# EAGLE design LCDbackpack (EAGLE 6.5.0)
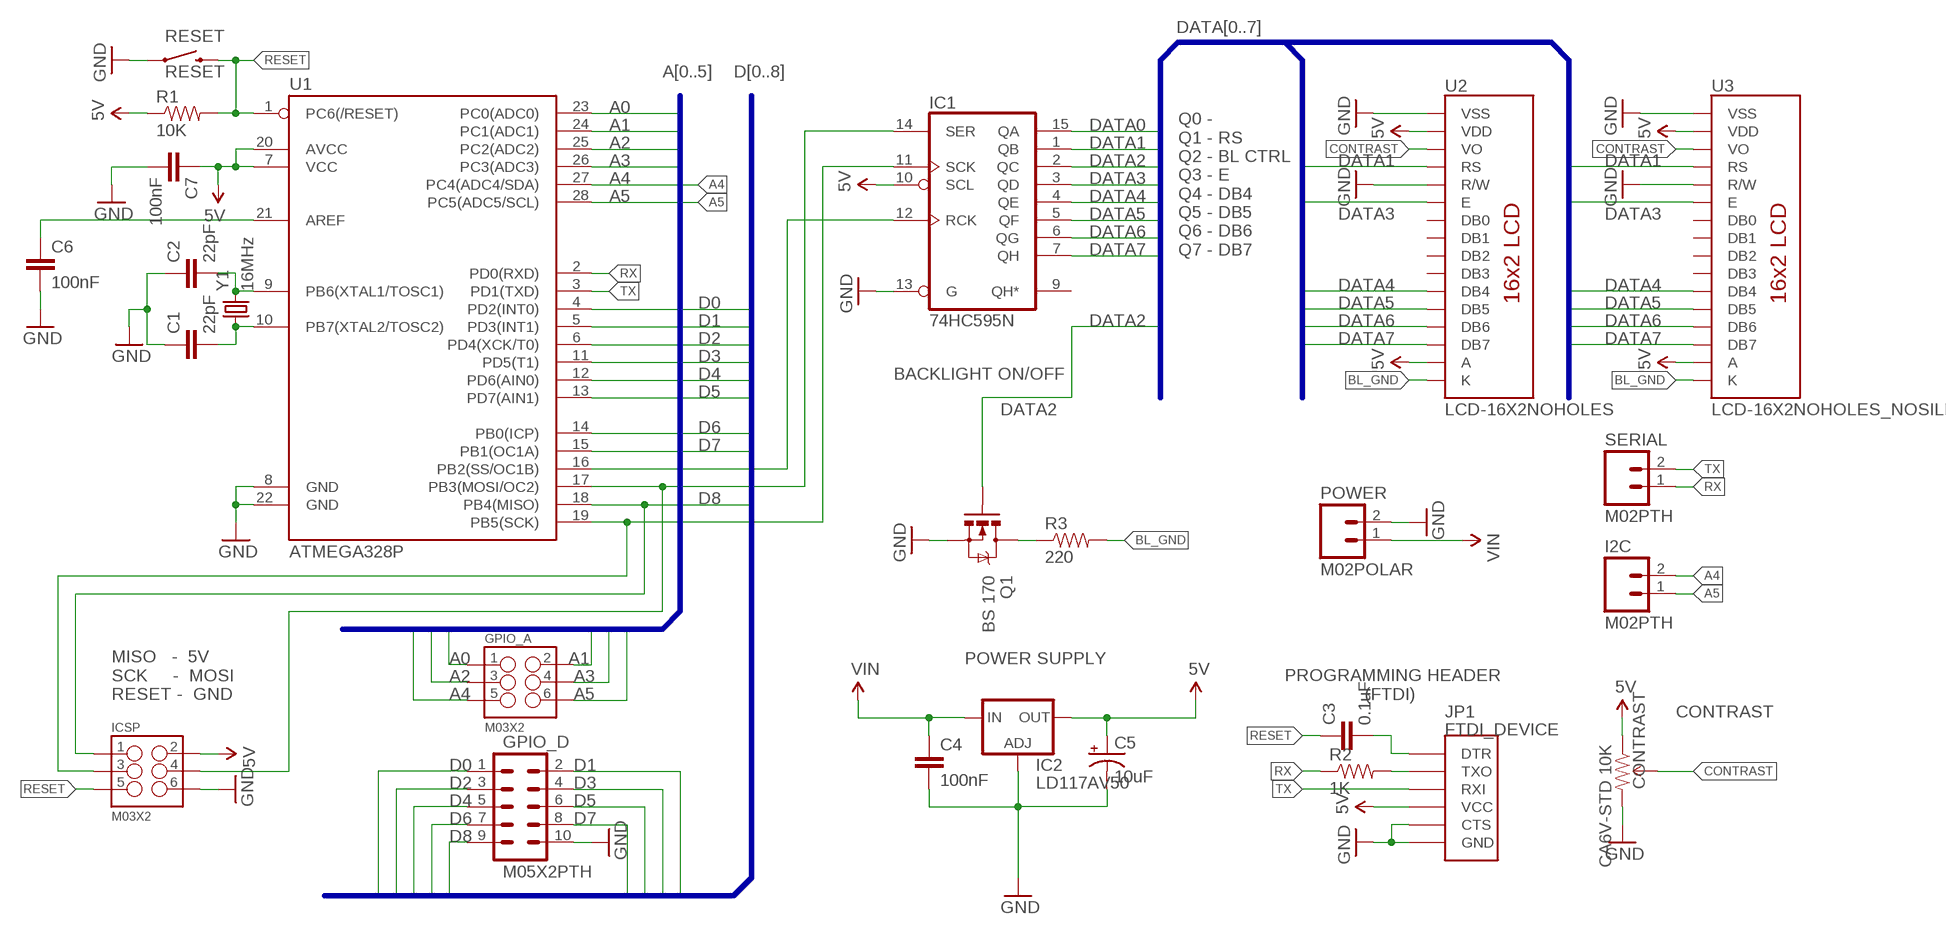
[diagram p0: schematic, sheet 1]

## Parts
C1  22pF  CAPPTH2  [CAP-PTH-SMALL2]
C2  22pF  CAPPTH2  [CAP-PTH-SMALL2]
C3  0.1uF  CAPPTH2  [CAP-PTH-SMALL2]
C4  100nF  CAPPTH2  [CAP-PTH-SMALL2]
C5  10uF  CAP_POLPTH2  [CPOL-RADIAL-10UF-25V]
C6  100nF  CAPPTH2  [CAP-PTH-SMALL2]
C7  100nF  CAPPTH2  [CAP-PTH-SMALL2]
CONTRAST  CA6V-STD 10K  TRIMPOTPTH  [TRIM_POT_PTH]
GPIO_A  M03X2  M03X22X3_SILK_MALE_PTH  [2X3]
GPIO_D  M05X2PTH  [AVR_ICSP]
I2C  M02PTH  [1X02]
IC1  74HC595N  [DIL16]
IC2  LD117AV50  [TO220L1]
ICSP  M03X2  M03X2POGO_PINS  [2X3_POGO]
JP1  FTDI_DEVICE  [FTDI_DEVICE_SIDE]
POWER  M02POLAR  [MOLEX-1X2]
Q1  BS 170  MOSFET-NCHANNEL2N7000  [TO-92]
R1  10K  RESISTORAXIAL-0.3  [AXIAL-0.3]
R2  1K  RESISTORAXIAL-0.3  [AXIAL-0.3]
R3  220  RESISTORAXIAL-0.3  [AXIAL-0.3]
RESET  RESET  SWITCH-MOMENTARY-2PTH  [TACTILE-PTH]
SERIAL  M02PTH  [1X02]
U1  ATMEGA328P  ATMEGA328P_PDIP  [DIL28-3]
U2  LCD-16X2NOHOLES  [LCD-16X2_NOHOLES]
U3  LCD-16X2NOHOLES_NOSILK  [LCD-8X2_NOHOLES_NOSILK]
Y1  16MHz  CRYSTALHC49US  [HC49US]

## Nets
A0: GPIO_A.1 U1.23(PC0(ADC0))
A1: GPIO_A.2 U1.24(PC1(ADC1))
A2: GPIO_A.3 U1.25(PC2(ADC2))
A3: GPIO_A.4 U1.26(PC3(ADC3))
A4: GPIO_A.5 I2C.2 U1.27(PC4(ADC4/SDA))
A5: GPIO_A.6 I2C.1 U1.28(PC5(ADC5/SCL))
BL_GND: R3.P$2 U2.16(K) U3.16(K)
CONTRAST: CONTRAST.2(WIPER) U2.3(VO) U3.3(VO)
D0: GPIO_D.1 U1.4(PD2(INT0))
D1: GPIO_D.2 U1.5(PD3(INT1))
D2: GPIO_D.3 U1.6(PD4(XCK/T0))
D3: GPIO_D.4 U1.11(PD5(T1))
D4: GPIO_D.5 U1.12(PD6(AIN0))
D5: GPIO_D.6 U1.13(PD7(AIN1))
D6: GPIO_D.7 U1.14(PB0(ICP))
D7: GPIO_D.8 U1.15(PB1(OC1A))
D8: GPIO_D.9 ICSP.P$1 U1.18(PB4(MISO))
DATA0: IC1.15(QA)
DATA1: IC1.1(QB) U2.4(RS) U3.4(RS)
DATA2: IC1.2(QC) Q1.2(G)
DATA3: IC1.3(QD) U2.6(E) U3.6(E)
DATA4: IC1.4(QE) U2.11(DB4) U3.11(DB4)
DATA5: IC1.5(QF) U2.12(DB5) U3.12(DB5)
DATA6: IC1.6(QG) U2.13(DB6) U3.13(DB6)
DATA7: IC1.7(QH) U2.14(DB7) U3.14(DB7)
GND: C1.1 C2.1 C4.2 C5.2(-) C6.2 C7.2 CONTRAST.3(CW) GPIO_D.10 IC1.13(G) IC2.1(ADJ) ICSP.P$6 JP1.P$5(CTS) JP1.P$6(GND) POWER.2 Q1.1(S) RESET.1 U1.8(GND) U1.22(GND) U2.1(VSS) U2.5(R/W) U3.1(VSS) U3.5(R/W)
N$1: C3.2 JP1.P$1(DTR)
N$2: JP1.P$2(TXO) R2.P$2
N$3: C2.2 U1.9(PB6(XTAL1/TOSC1)) Y1.2
N$4: C1.2 U1.10(PB7(XTAL2/TOSC2)) Y1.1
N$5: IC1.14(SER) ICSP.P$4 U1.17(PB3(MOSI/OC2))
N$6: Q1.3(D) R3.P$1
N$8: IC1.12(RCK) U1.16(PB2(SS/OC1B))
N$9: IC1.11(SCK) ICSP.P$3 U1.19(PB5(SCK))
N$10: C6.1 U1.21(AREF)
RESET: C3.1 ICSP.P$5 R1.P$2 RESET.3 U1.1(PC6(/RESET))
RX: R2.P$1 SERIAL.1 U1.2(PD0(RXD))
TX: JP1.P$3(RXI) SERIAL.2 U1.3(PD1(TXD))
VCC: C5.1(+) C7.1 CONTRAST.1(CCW) IC1.10(SCL) IC2.2(OUT) ICSP.P$2 JP1.P$4(VCC) R1.P$1 U1.7(VCC) U1.20(AVCC) U2.2(VDD) U2.15(A) U3.2(VDD) U3.15(A) ; supply symbol labelled 5V
VIN: C4.1 IC2.3(IN) POWER.1
Unconnected: IC1.9(QH*) U2.7(DB0) U2.8(DB1) U2.9(DB2) U2.10(DB3) U3.7(DB0) U3.8(DB1) U3.9(DB2) U3.10(DB3)

## Buses
DATA[0..7]
D[0..8]
A[0..5]

## Notes on the sheet
- Q0 - 
  Q1 - RS
  Q2 - BL CTRL
  Q3 - E
  Q4 - DB4
  Q5 - DB5
  Q6 - DB6
  Q7 - DB7
- BACKLIGHT ON/OFF
- POWER SUPPLY
- MISO   -  5V
  SCK     -  MOSI
  RESET -  GND
- PROGRAMMING HEADER
                  (FTDI)
- CONTRAST

## Power pins joined to a net without a drawn wire
GND: IC1.8(GND)
VCC: IC1.16(VCC)

## Library data of the parts
C1-C4 C6 C7 = SparkFun-Capacitors:CAP: Capacitor Standard 0603 ceramic capacitor, and 0.1" leaded capacitor.
C5 = SparkFun-Capacitors:CAP_POL: Capacitor Polarized These are standard SMD and PTH capacitors. Normally 10uF, 47uF, and 100uF in electrolytic and tantalum varieties. Always verify the external diameter of the through hole cap, it varies with capacity, voltage, and manufacturer. The EIA devices should be standard.
CONTRAST = SparkFun-Electromechanical:TRIMPOT: Various small potentiometers for "set-and-forget" applications
GPIO_A = SparkFun-Connectors:M03X2: 2x3 .1" header. Shrouded, with keying- CONN-10681 SMT- CONN-11415 Pogo pins- HW-11044; PROD_ID: CONN-09701
GPIO_D = SparkFun-Connectors:M05X2: Header 5x2 Standard 10-pin dual row 0.1" header. Commonly used with AVR-ISP. Use with Spark Fun Electronics SKU: PRT-00778
I2C POWER SERIAL = SparkFun-Connectors:M02: Standard 2-pin 0.1" header. Use with - straight break away headers ( PRT-00116) - right angle break away headers (PRT-00553) - swiss pins (PRT-00743) - machine pins (PRT-00117) - female headers (PRT-00115) Molex polarized connector foot print use with: PRT-08233 with associated crimp pins and housings. 2.54_SCREWTERM for use with PRT-10571. 3.5mm Screw Terminal footprints for PRT-08084 5mm Screw Terminal footprints for use with PRT-08432
IC1 = 74xx-eu:74*595: 8-bit SHIFT REGISTER, output latch
IC2 = v-reg:LD117A?*: Low drop fixed and adjustable positive voltage regulators 1 A Source: http://www.st.com/stonline/products/literature/ds/7194/ld1117axx.pdf
ICSP = SparkFun-Connectors:M03X2: 2x3 .1" header. Shrouded, with keying- CONN-10681 SMT- CONN-11415 Pogo pins- HW-11044; PROD_ID: HW-11044
JP1 = SparkFun-Connectors:FTDI_DEVICE: Connector which mates to FTDI basic or FTDI cable.
Q1 = SparkFun-DiscreteSemi:MOSFET-NCHANNEL: Common NMOSFET Parts MFG P/N Store ID Prod ID FDD8780 TRANS-09984 SI7820DN TRANS-11055 FDS6630A IC-08089 2N7002PW TRANS-11151 FQP30N06L COM-10213 TRANS-10060 BSS123LT1G TRANS-08345 BSS138 TRANS-00830 BS170 2N7000
R1-R3 = SparkFun-Passives:RESISTOR: Resistor Basic schematic elements and footprints for 0603, 1206, and PTH resistors.
RESET = SparkFun-Electromechanical:SWITCH-MOMENTARY-2: Various NO switches- pushbuttons, reed, etc
U1 = SparkFun-DigitalIC:ATMEGA328P_PDIP: uC used in the Arduino 32kb flash, 1k EEPROM, 2k SRAM This is the through-hole version of this chip.
U2 U3 = SparkFun-Displays:LCD-16X2: Standard text-only 16x2 parallel input LCD
Y1 = SparkFun-FreqCtrl:CRYSTAL: Various standard crystals. Proven footprints.

## Board
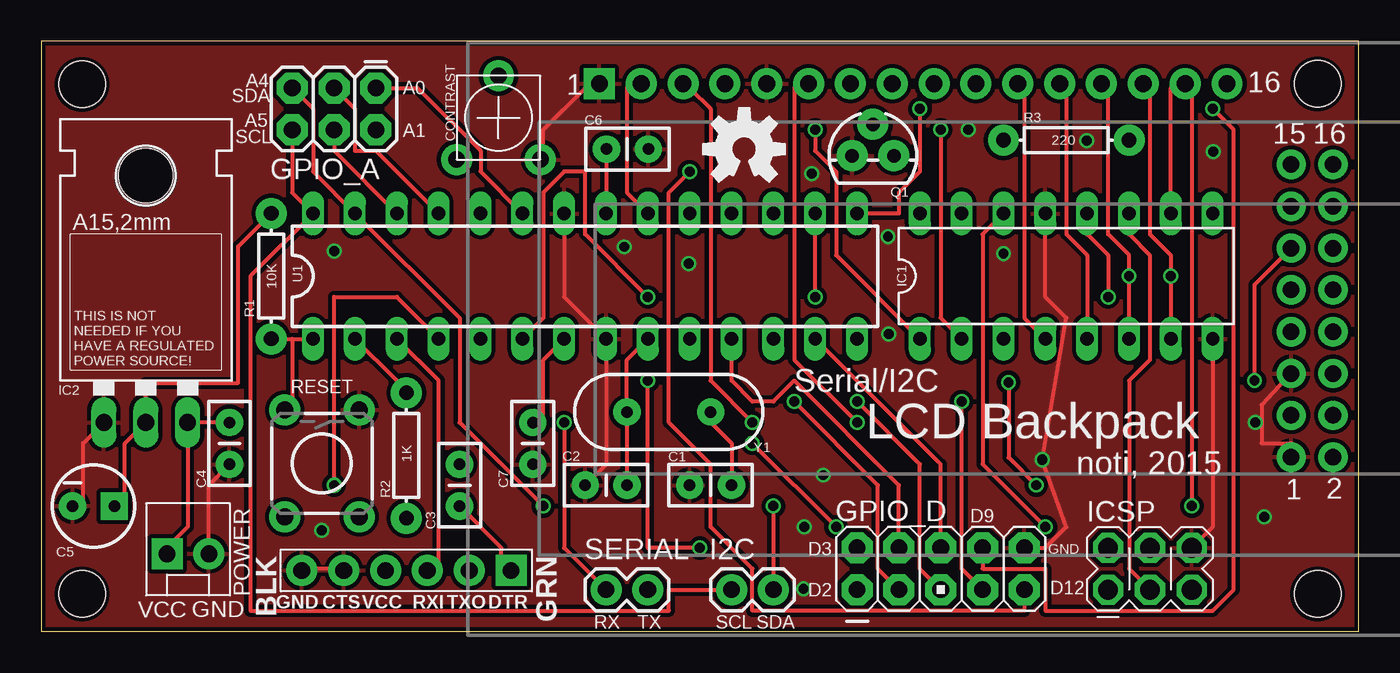
[diagram p1: board, top side]
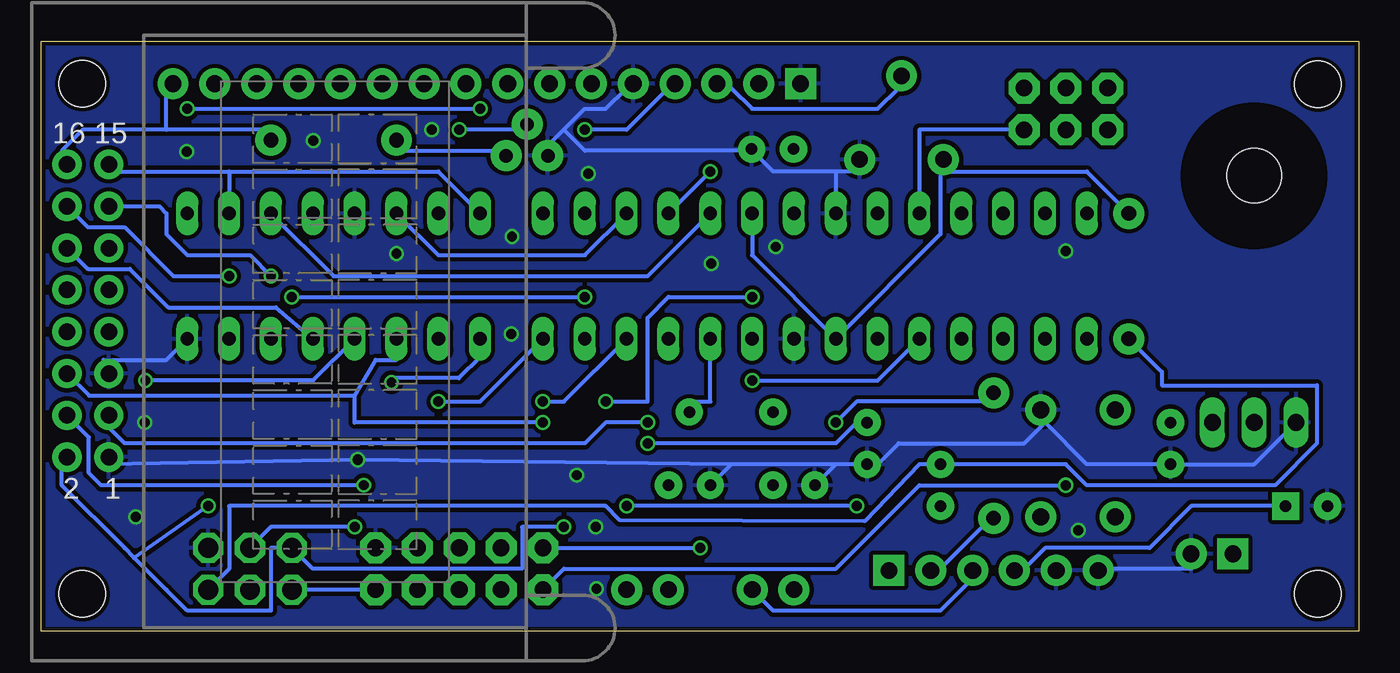
[diagram p2: board, bottom side, seen from below]

Size 79.99 x 35.87 mm. Coordinates in mm from the lower left corner, seen from the top.
Outline: 0,0 79.99,0 79.99,35.87 0,35.87 0,0
Copper layers (1*16): Top 0.035mm / dielectric 1.5mm / Bottom 0.035mm
Design rules "dirt_cheap_dirty_boards.v1": minimum track width 5mil, minimum drill 12mil, track to track 5mil, track to pad 5mil, pad to pad 5mil, via to via 5mil, smd to smd 0mil, copper to edge 10mil, drill to drill 10mil, minimum pad ring 10mil, minimum via ring 6mil, stop-mask expansion 2mil, vias tented up to drill 25mil, thermal gap 10mil
Holes 2.8 mm at 2.49,33.25 2.49,2.29 77.5,2.29 77.5,33.27

### Footprints (pad centres in the part's own frame; a part is rotated, then mirrored left to right if it is on the bottom)
CAP-PTH-SMALL2 = drill 0.7 pad 1.651: 1 0,0; 2 2.54,0
CPOL-RADIAL-10UF-25V = drill 0.7 pad 1.651 square: 1 1.27,0 | drill 0.7 pad 1.651: 2 -1.27,0
TRIM_POT_PTH = drill 1 pad 1.88: 1 -2.54,-2.54; 2 0,2.54; 3 2.54,-2.54
2X3 = drill 1.016 pad 1.88 octagon: 1 0,0; 2 0,2.54; 3 2.54,0; 4 2.54,2.54; 5 5.08,0; 6 5.08,2.54
AVR_ICSP = drill 1.016 pad 1.88 octagon: 1 -1.27,5.08; 2 1.27,5.08; 3 -1.27,2.54; 4 1.27,2.54; 5 -1.27,0; 6 1.27,0; 7 -1.27,-2.54; 8 1.27,-2.54; 9 -1.27,-5.08; 10 1.27,-5.08
1X02 = drill 1.016 pad 1.88: 1 0,0; 2 2.54,0
DIL16 = drill 0.813 long: 1 -8.89,-3.81; 2 -6.35,-3.81; 3 -3.81,-3.81; 4 -1.27,-3.81; 5 1.27,-3.81; 6 3.81,-3.81; 7 6.35,-3.81; 8 8.89,-3.81; 9 8.89,3.81; 10 6.35,3.81; 11 3.81,3.81; 12 1.27,3.81; 13 -1.27,3.81; 14 -3.81,3.81; 15 -6.35,3.81; 16 -8.89,3.81
TO220L1 = drill 1.016 long: 1 -2.54,-3.81; 2 0,-3.81; 3 2.54,-3.81 | hole 3.302: 0,11.176
2X3_POGO = drill 1.2 pad 1.829 octagon: P$1 0,0; P$2 0,2.54; P$3 2.54,0; P$4 2.54,2.54; P$5 5.08,0; P$6 5.08,2.54
FTDI_DEVICE_SIDE = drill 1.016 pad 1.88 square: P$1 -6.35,0 | drill 1.016 pad 1.88: P$2 -3.81,0; P$3 -1.27,0; P$4 1.27,0; P$5 3.81,0; P$6 6.35,0
MOLEX-1X2 = drill 1.016 pad 1.88 square: 1 0,0 | drill 1.016 pad 1.88: 2 2.54,0
TO-92 = drill 0.813 pad 1.88: 1 -1.27,0; 2 0,1.905; 3 1.27,0
AXIAL-0.3 = drill 0.9 pad 1.88: P$1 -3.81,0; P$2 3.81,0
TACTILE-PTH = drill 1.016 pad 1.88: 1 -3.251,2.261; 2 3.251,2.261; 3 -3.251,-2.261; 4 3.251,-2.261
DIL28-3 = drill 0.813 long: 1 -16.51,-3.81; 2 -13.97,-3.81; 3 -11.43,-3.81; 4 -8.89,-3.81; 5 -6.35,-3.81; 6 -3.81,-3.81; 7 -1.27,-3.81; 8 1.27,-3.81; 9 3.81,-3.81; 10 6.35,-3.81; 11 8.89,-3.81; 12 11.43,-3.81; 13 13.97,-3.81; 14 16.51,-3.81; 15 16.51,3.81; 16 13.97,3.81; 17 11.43,3.81; 18 8.89,3.81; 19 6.35,3.81; 20 3.81,3.81; 21 1.27,3.81; 22 -1.27,3.81; 23 -3.81,3.81; 24 -6.35,3.81; 25 -8.89,3.81; 26 -11.43,3.81; 27 -13.97,3.81; 28 -16.51,3.81
LCD-16X2_NOHOLES = drill 1.016 pad 1.88 square: 1 -32,15.5 | drill 1.016 pad 1.88: 2 -29.46,15.5; 3 -26.92,15.5; 4 -24.38,15.5; 5 -21.84,15.5; 6 -19.3,15.5; 7 -16.76,15.5; 8 -14.22,15.5; 9 -11.68,15.5; 10 -9.14,15.5; 11 -6.6,15.5; 12 -4.06,15.5; 13 -1.52,15.5; 14 1.02,15.5; 15 3.56,15.5; 16 6.1,15.5
LCD-8X2_NOHOLES_NOSILK = drill 1 pad 1.778: 1 -7.62,13.73; 2 -7.62,16.27; 3 -5.08,13.73; 4 -5.08,16.27; 5 -2.54,13.73; 6 -2.54,16.27; 7 0,13.73; 8 0,16.27; 9 2.54,13.73; 10 2.54,16.27; 11 5.08,13.73; 12 5.08,16.27; 13 7.62,13.73; 14 7.62,16.27; 15 10.16,13.73; 16 10.16,16.27
HC49US = drill 0.7 pad 1.651: 1 -2.54,0; 2 2.54,0

### Placement (x,y rotation side)
C1  39.37,8.89 0 top
C2  33.02,8.89 0 top
C3  25.4,10.16 270 top
C4  11.43,12.7 270 top
C5  3.17,7.62 0 top
C6  34.32,29.31 0 top
C7  29.84,12.7 270 top
CONTRAST  27.76,31.22 0 top
GPIO_A  20.32,33.02 180 top
GPIO_D  54.61,3.81 90 top
I2C  41.91,2.54 0 top
IC1  62.23,21.59 0 top
IC2  6.35,16.51 0 top
ICSP  64.77,2.54 0 top
JP1  22.17,3.71 180 top
POWER  7.65,4.72 0 top
Q1  50.5,28.91 0 top
R1  13.97,21.59 270 top
R2  22.17,10.69 270 top
R3  62.23,29.84 0 top
RESET  17.04,10.21 270 top
SERIAL  34.29,2.54 0 top
U1  33.02,21.59 0 top
U2  65.89,17.78 0 top
U3  62.15,18.21 90 bottom
U$1  [OSHW-LOGO-M]  42.67,29.31 0 top
Y1  38.1,13.34 180 top

### Tracks (layer width: path | path; a pad name or v marks a point on that pad's centre or on a via)
A0
  Top 0.254: U1.23 26.67,27.94 26.67,29.21 22.86,33.02 GPIO_A.1
A1
  Bottom 0.254: U1.24 26.67,30.48 GPIO_A.2
A2
  Top 0.254: U1.25 20.32,29.21 19.05,29.21 19.05,31.75 GPIO_A.3
A3
  Top 0.254: U1.26 17.78,29.21 GPIO_A.4
A4  (via drill 0.61)
  Top 0.254: GPIO_A.5 16.51,31.75 16.51,27.94 U1.27 25.4,19.05 25.4,12.7 v30.48,7.62 | v44.45,7.62 I2C.2
  Bottom 0.254: v30.48,7.62 v44.45,7.62
A5
  Top 0.254: GPIO_A.6 15.24,26.67 U1.28 12.7,21.59 12.7,1.27 38.1,1.27 38.1,2.54 I2C.1
BL_GND
  Bottom 0.254: 72.39,30.48 66.04,30.48 R3.P$2 | 72.39,30.48 77.47,30.48 78.74,29.21 U3.16 | 72.39,30.48 72.39,33.02 U2.16
CONTRAST  (via drill 0.61)
  Top 0.254: v43.18,12.7 40.64,15.24 40.64,31.75 39.37,33.02 U2.3
  Bottom 0.254: v43.18,12.7 45.72,12.7 46.99,11.43 74.93,11.43 76.2,12.7 U3.3 | CONTRAST.2 27.94,33.02 29.21,31.75 36.83,31.75 38.1,33.02 U2.3
D0  (via drill 0.61)
  Top 0.254: U1.4 21.59,20.32 17.78,20.32 v17.78,8.89
  Bottom 0.254: v17.78,8.89 26.67,8.89 31.75,3.81 48.26,3.81 GPIO_D.1
D1  (via drill 0.61)
  Top 0.254: v39.98,5.08 36.83,5.08 v36.83,15.24
  Bottom 0.254: U1.5 29.21,15.24 v36.83,15.24 | GPIO_D.2 v39.98,5.08
D2  (via drill 0.61)
  Top 0.254: U1.6 30.48,19.05 30.48,26.67 31.75,27.94 33.02,27.94 33.02,24.13 v36.83,20.32 | v45.72,13.97 50.8,8.89 50.8,3.81 GPIO_D.3
  Bottom 0.254: v36.83,20.32 41.91,20.32 43.18,19.05 43.18,13.97 v45.72,13.97
D3
  Top 0.254: U1.11 41.91,15.24 43.18,13.97 44.45,13.97 45.72,15.24 52.07,8.89 GPIO_D.4
D4  (via drill 0.61)
  Top 0.254: v49.53,13.97 53.34,10.16 53.34,3.81 GPIO_D.5
  Bottom 0.254: U1.12 48.26,13.97 v49.53,13.97
D5
  Top 0.254: U1.13 54.61,10.16 GPIO_D.6
D6  (via drill 0.61)
  Top 0.254: v55.88,13.97 55.88,3.81 GPIO_D.7
  Bottom 0.254: U1.14 53.34,13.97 v55.88,13.97
D7  (via drill 0.61)
  Top 0.254: U1.15 52.07,25.4 52.07,26.67 53.34,27.94 v53.34,31.75 | v71.12,31.75 72.39,30.48 72.39,2.54 71.12,1.27 60.96,1.27 60.96,3.81 57.15,3.81 GPIO_D.8
  Bottom 0.254: v71.12,31.75 v53.34,31.75
D8  (via drill 0.61)
  Top 0.254: v39.37,27.94 38.1,26.67 38.1,12.7 40.64,10.16 40.64,6.35 43.18,3.81 43.18,1.27 59.69,1.27 GPIO_D.9
  Bottom 0.254: v39.37,27.94 U1.18 | GPIO_D.9 ICSP.P$1
DATA1  (via drill 0.6, 0.61)
  Top 0.254: IC1.1 48.26,22.86 48.26,27.94 46.99,29.21 v46.99,30.48 | v58.73,15.14 58.73,10.57 v60.4,8.89
  Bottom 0.254: v46.99,30.48 44.45,30.48 41.91,33.02 U2.4 | IC1.1 53.34,16.69 54.63,15.39 58.47,15.39 v58.73,15.14 | v60.4,8.89 76.35,8.89 77.09,9.63 77.09,11.8 U3.4
DATA2  (via drill 0.61)
  Top 0.254: IC1.2 54.61,19.05 v54.61,30.48
  Bottom 0.254: v54.61,30.48 50.8,30.48 Q1.2
DATA3  (via drill 0.61)
  Top 0.254: v49.53,12.7 45.72,16.51 45.72,33.02 U2.6
  Bottom 0.254: 60.96,14.33 60.96,12.7 v49.53,12.7 | 60.96,14.33 59.69,16.51 58.42,16.51 IC1.3 | U3.6 77.08,14.33 60.96,14.33
DATA4  (via drill 0.6)
  Top 0.254: IC1.4 59.69,19.05 59.69,33.02 U2.11 | v73.66,15.24 73.66,21.07 U3.11
  Bottom 0.254: v73.66,15.24 63.5,15.24 IC1.4
DATA5
  Top 0.254: IC1.5 63.5,22.86 62.23,24.13 62.23,33.02 U2.12
  Bottom 0.254: U3.12 77.15,22.02 74.6,22.02 72.26,19.68 65.73,19.68 IC1.5
DATA6  (via drill 0.6)
  Top 0.254: IC1.6 v66.04,21.59 66.04,22.86 64.77,24.13 64.77,33.02 U2.13
  Bottom 0.254: U3.13 72.82,25.83 72.39,25.4 72.39,24.13 71.12,22.86 67.31,22.86 v66.04,21.59
DATA7  (via drill 0.6)
  Top 0.254: IC1.7 v68.58,21.59 68.58,22.86 67.31,24.13 67.31,33.02 U2.14
  Bottom 0.254: U3.14 77.15,24.56 74.93,24.56 71.96,21.59 v68.58,21.59
GND  (via drill 0.6, 0.61)
  Top 0.254: IC2.1 2.54,11.43 2.54,7.62 C5.2 | JP1.P$6 16.51,3.81 17.78,3.81 JP1.P$5 | C4.2 10.16,8.89 10.16,5.08 POWER.2 | IC1.13 60.96,20.32 62.23,19.05 v60.78,10.44 62.23,6.35 60.96,5.08 GPIO_D.10 | U3.1 75.87,11.43 74.09,11.43 74.09,13.77 U3.5 | ICSP.P$6 71.12,6.35 IC1.8 | U1.22 31.75,20.32 U1.8 34.29,10.16 C2.1 | U2.1 33.02,33.02 30.48,30.48 30.48,29.21 CONTRAST.3
  Bottom 0.254: 19.05,12.7 16.51,10.16 C4.2 6.35,10.16 IC2.1 | JP1.P$6 15.24,3.81 10.16,3.81 POWER.2 | IC1.8 72.39,16.51 76.2,16.51 U3.5 | 48.26,30.48 49.53,29.21 Q1.1 | 48.26,30.48 46.99,31.75 45.72,31.75 44.45,33.02 U2.5 | 31.75,10.16 C2.1 | 31.75,10.16 C7.2 29.21,10.16 27.94,11.43 20.32,11.43 19.05,12.7 | 38.1,10.16 C1.1 | 31.75,10.16 38.1,10.16 | 31.75,27.94 U1.22 | 31.75,27.94 30.48,27.94 CONTRAST.3 | 36.83,29.21 35.56,27.94 31.75,27.94 | 48.26,30.48 46.99,29.21 36.83,29.21 | 36.83,29.21 C6.2 | 38.1,10.16 v60.78,10.44 76.2,10.16 U3.1 | 19.05,12.7 RESET.1
  other vias: 17.78,23.11 39.32,22.35 47.47,9.5 46.28,2.59 46.79,27.81 51.41,24 51.46,18.08 56.29,30.48 58.42,22.96 35.41,23.37 63.47,29.82 71.15,29.16 74.24,6.96 73.71,12.7 17.04,6.15 46.33,6.35
  pour Bottom (isolate 0.254): -2.54,36.83 -2.54,-1.27 81.28,-1.27 81.28,36.83
  pour Top (isolate 0.254): 83.82,36.83 83.82,-1.27 -1.27,-1.27 -1.27,36.83
N$1
  Top 0.254: C3.2 27.94,5.08 27.94,3.81 JP1.P$1
N$2
  Bottom 0.254: R2.P$2 22.86,6.35 25.4,3.81 JP1.P$2
N$3
  Top 0.254: U1.9 35.56,16.51 Y1.2 C2.2
N$4
  Top 0.254: C1.2 41.91,11.43 40.64,12.7 Y1.1
  Bottom 0.254: U1.10 39.37,13.97 40.64,13.97 Y1.1
N$5  (via drill 0.61)
  Top 0.254: v60.96,6.35 57.15,10.16 57.15,24.13 IC1.14
  Bottom 0.254: U1.17 46.99,22.86 55.88,22.86 IC1.14 | ICSP.P$4 66.04,6.35 v60.96,6.35
N$6
  Bottom 0.254: Q1.3 52.07,29.21 58.42,29.21 R3.P$1
N$8  (via drill 0.61)
  Top 0.254: v46.99,20.32 U1.16 | v64.77,20.32 64.77,22.86 63.5,24.13 IC1.12
  Bottom 0.254: v64.77,20.32 v46.99,20.32
N$9
  Top 0.254: ICSP.P$3 66.04,3.81 66.04,15.24 67.31,16.51 67.31,22.86 66.04,24.13 IC1.11
  Bottom 0.254: U1.19 43.18,21.59 62.23,21.59 IC1.11
N$10
  Top 0.254: U1.21 34.29,29.21 C6.1
RESET
  Top 0.254: R1.P$2 15.24,17.78 | 15.24,17.78 U1.1 | 15.24,17.78 15.24,13.97 RESET.3
  Bottom 0.254: R1.P$2 11.96,15.77 11.96,14.96 2.54,14.96 2.54,11.43 5.08,8.89 16.51,8.89 17.78,10.16 C3.1 26.67,10.16 30,6.71 44.86,6.76 45.72,7.62 68.58,7.62 68.58,3.81 ICSP.P$5
RX  (via drill 0.61)
  Top 0.254: U1.2 21.59,15.24 R2.P$1 | SERIAL.1 31.75,5.08 v31.75,12.7
  Bottom 0.254: v31.75,12.7 30.48,13.97 22.86,13.97 R2.P$1
TX
  Top 0.254: U1.3 24.13,15.24 24.13,3.81 JP1.P$3
  Bottom 0.254: SERIAL.2 35.56,1.27 25.4,1.27 22.86,3.81 JP1.P$3
VCC  (via drill 0.61)
  Top 0.254: IC1.10 68.58,33.02 U2.15 69.85,33.02 v69.85,7.62 | U1.7 30.48,16.51 30.48,12.7 C7.1 | U1.20 35.56,26.67 35.56,33.02 U2.2 | C5.1 5.08,7.62 5.08,11.43 IC2.2 6.35,15.11 11.96,15.11 11.96,23.39 R1.P$1 | v43.18,11.43 v48.26,6.35
  Bottom 0.254: 74.35,4.47 72.39,2.54 71.12,1.27 66.04,1.27 66.04,5.08 ICSP.P$2 63.5,3.81 50.8,3.81 50.8,6.35 v48.26,6.35 | 74.35,4.47 74.93,5.08 78.74,8.89 78.74,10.16 U3.2 | IC1.16 55.88,27.94 68.58,27.94 | 68.58,27.94 76.2,27.94 U3.15 | 68.58,27.94 IC1.10 | v69.85,7.62 74.35,4.47 | U1.20 36.83,22.86 U1.7 25.4,24.13 25.4,27.94 | R1.P$1 16.51,27.94 25.4,27.94 | C5.1 10.16,7.62 12.7,5.08 19.05,5.08 20.32,3.81 JP1.P$4 | 25.4,27.94 CONTRAST.1 | v43.18,11.43 31.75,11.43 30.48,12.7 C7.1
VIN
  Top 0.254: C4.1 IC2.3 8.89,6.35 7.62,5.08 POWER.1

### Text on the board
tNames: A4 | SDA | A0 | 1 | 16 | A5 | SCL | A1 | 15 | 16 | THIS IS NOT / NEEDED IF YOU / HAVE A REGULATED / POWER SOURCE! | Serial/I2C | LCD Backpack | noti, 2015 | 1 | 2 | D9 | D3 | GND | D2 | POWER | D12 | VCC | GND | RX | TX | SCL | SDA